# Altium schematic sheet 1) LPC1850_ P0-P4.SchDoc
size 420 x 297 mm
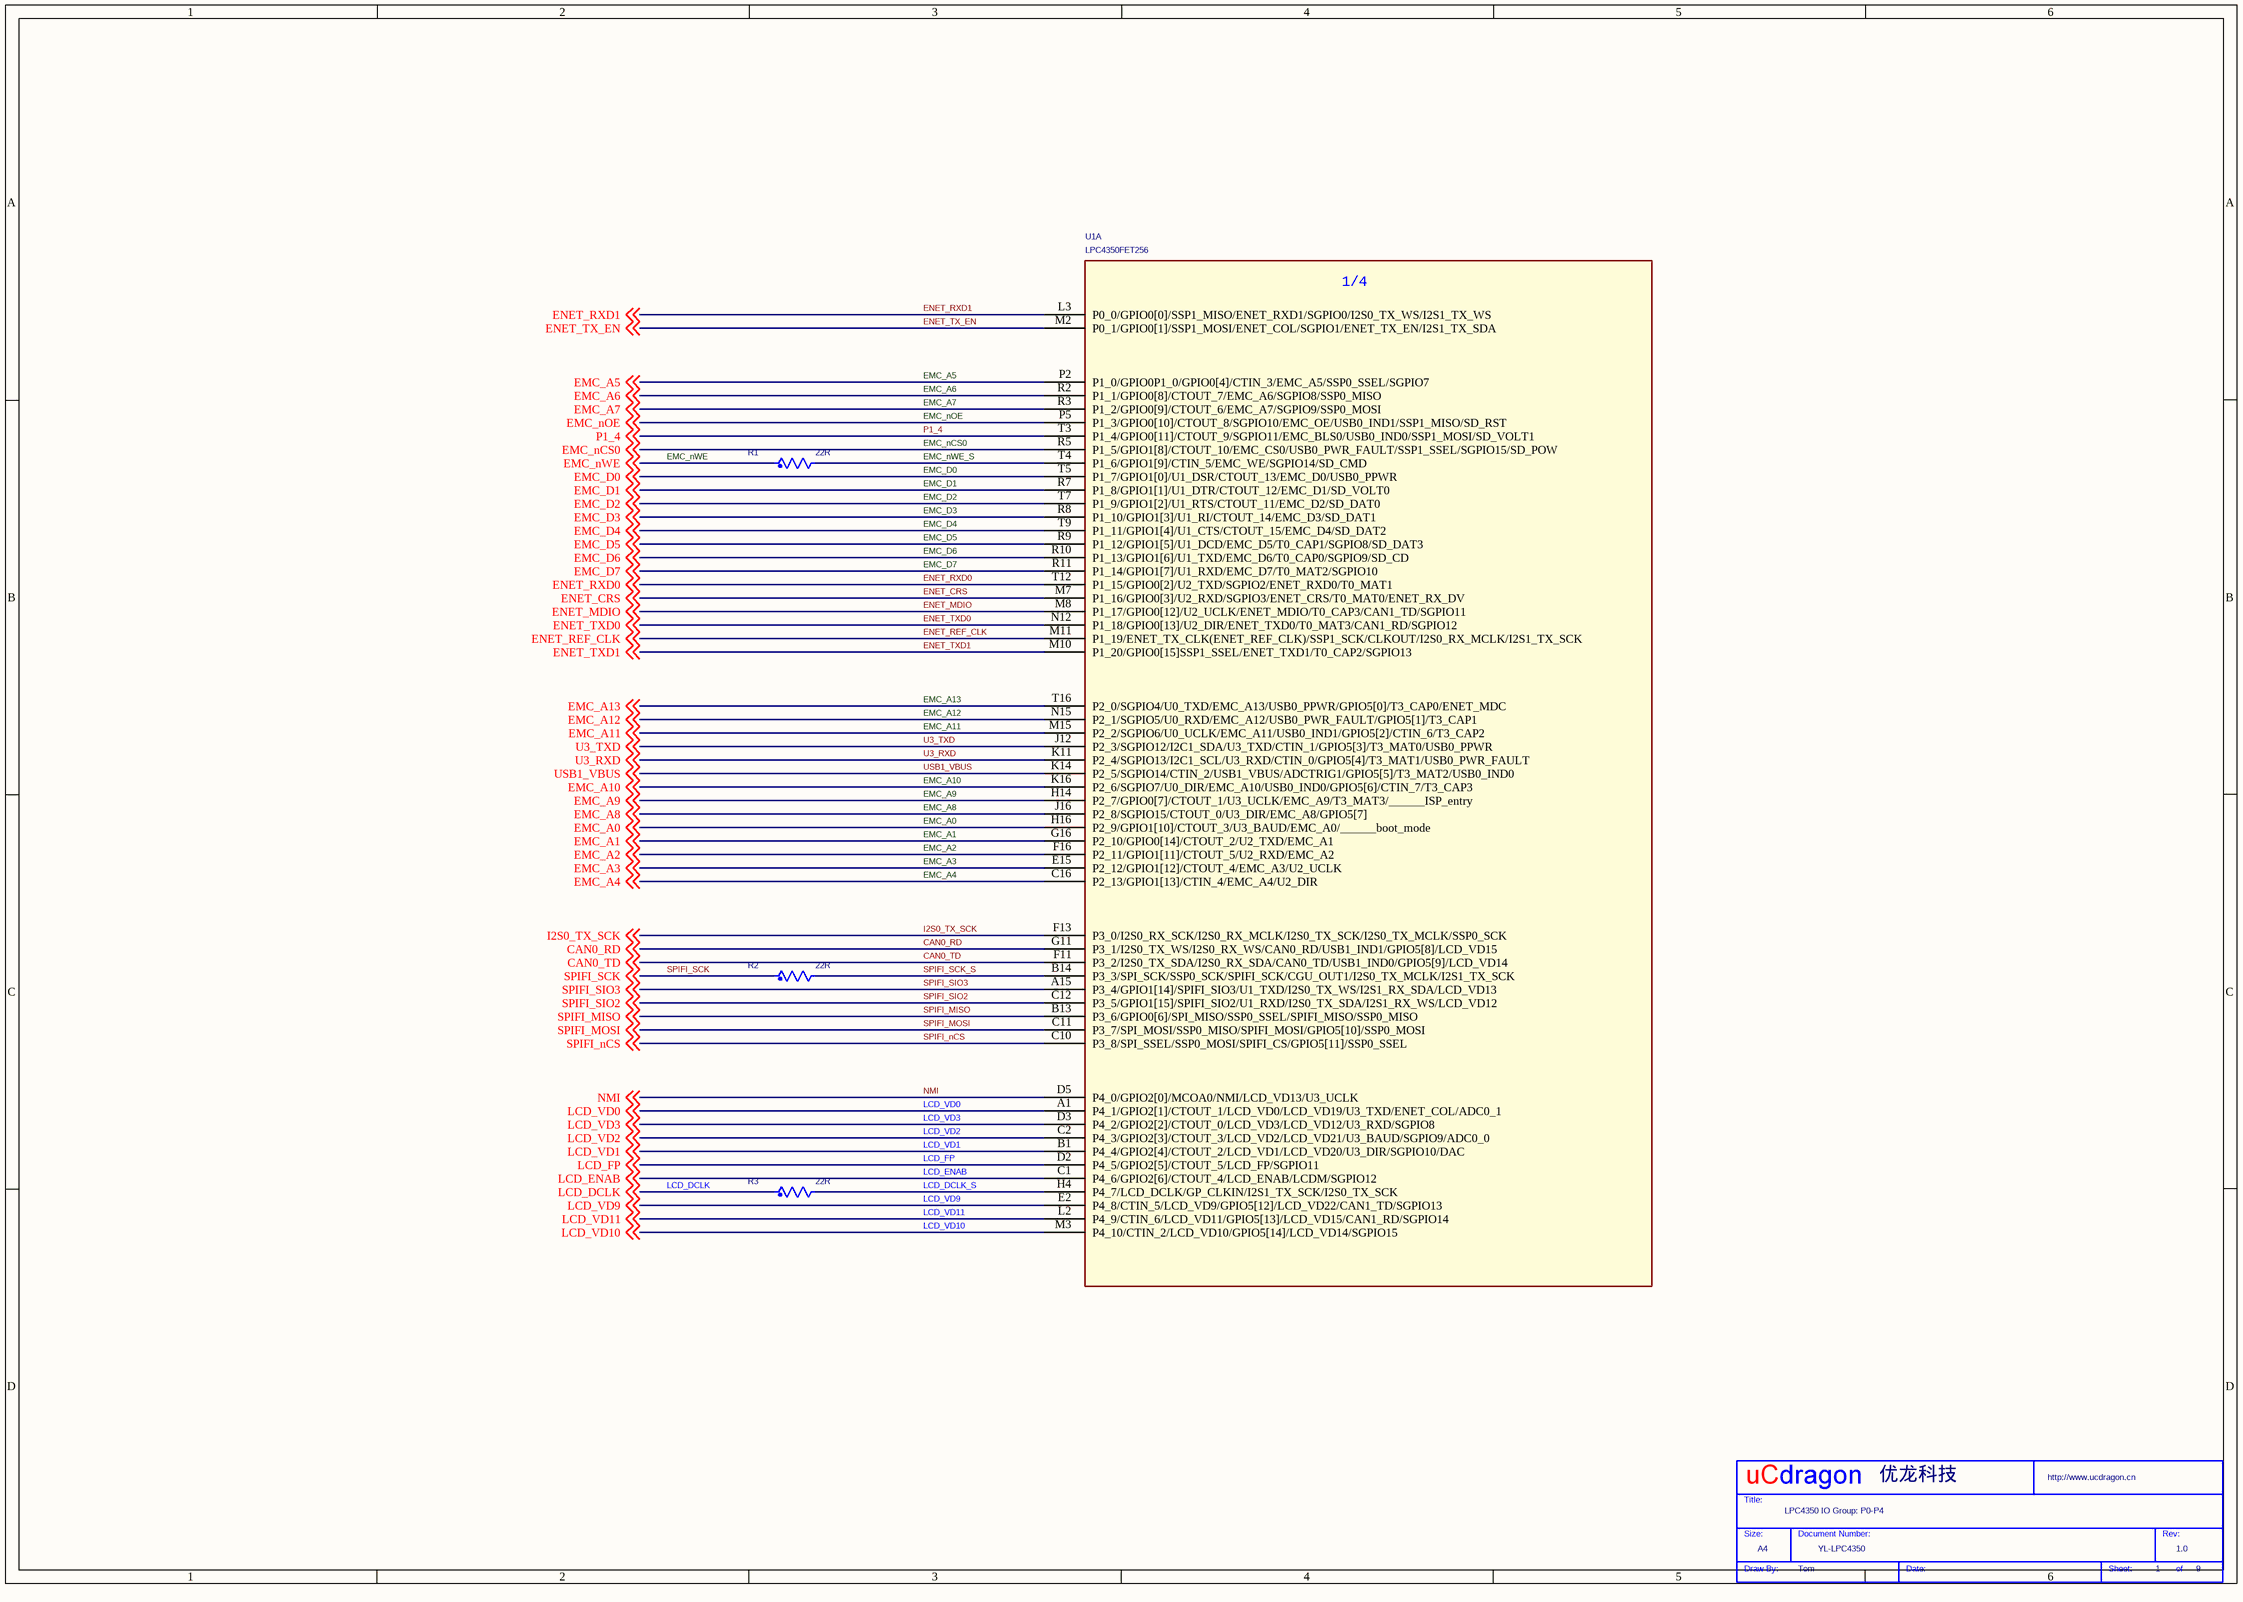
[diagram p0: 1) LPC1850_ P0-P4.SchDoc]

## Parts
*  Company: 优龙科技  Drawing: Tom  Doc: YL-LPC4350  RevCode: 1.0  Title: LPC4350 IO Group: P0-P4  Page Size: A4  Page Number: 1  Page Count: 9  (hidden comment: My Title 0)  (graphical)
R1  22R  [R0603]
R2  22R  [R0603]
R3  22R  [R0603]
U1  LPC4350FET256  [LBGA256]  (part A of 4)

## Nets
CAN0_RD: U1.G11(P3_1/I2S0_TX_WS/I2S0_RX_WS/CAN0_RD/USB1_IND1/GPIO5[8]/LCD_VD15) ; off-sheet CAN0_RD
CAN0_TD: U1.F11(P3_2/I2S0_TX_SDA/I2S0_RX_SDA/CAN0_TD/USB1_IND0/GPIO5[9]/LCD_VD14) ; off-sheet CAN0_TD
EMC_A0: U1.H16(P2_9/GPIO1[10]/CTOUT_3/U3_BAUD/EMC_A0/______boot_mode) ; off-sheet EMC_A0
EMC_A1: U1.G16(P2_10/GPIO0[14]/CTOUT_2/U2_TXD/EMC_A1) ; off-sheet EMC_A1
EMC_A2: U1.F16(P2_11/GPIO1[11]/CTOUT_5/U2_RXD/EMC_A2) ; off-sheet EMC_A2
EMC_A3: U1.E15(P2_12/GPIO1[12]/CTOUT_4/EMC_A3/U2_UCLK) ; off-sheet EMC_A3
EMC_A4: U1.C16(P2_13/GPIO1[13]/CTIN_4/EMC_A4/U2_DIR) ; off-sheet EMC_A4
EMC_A5: U1.P2(P1_0/GPIO0P1_0/GPIO0[4]/CTIN_3/EMC_A5/SSP0_SSEL/SGPIO7) ; off-sheet EMC_A5
EMC_A6: U1.R2(P1_1/GPIO0[8]/CTOUT_7/EMC_A6/SGPIO8/SSP0_MISO) ; off-sheet EMC_A6
EMC_A7: U1.R3(P1_2/GPIO0[9]/CTOUT_6/EMC_A7/SGPIO9/SSP0_MOSI) ; off-sheet EMC_A7
EMC_A8: U1.J16(P2_8/SGPIO15/CTOUT_0/U3_DIR/EMC_A8/GPIO5[7]) ; off-sheet EMC_A8
EMC_A9: U1.H14(P2_7/GPIO0[7]/CTOUT_1/U3_UCLK/EMC_A9/T3_MAT3/______ISP_entry) ; off-sheet EMC_A9
EMC_A10: U1.K16(P2_6/SGPIO7/U0_DIR/EMC_A10/USB0_IND0/GPIO5[6]/CTIN_7/T3_CAP3) ; off-sheet EMC_A10
EMC_A11: U1.M15(P2_2/SGPIO6/U0_UCLK/EMC_A11/USB0_IND1/GPIO5[2]/CTIN_6/T3_CAP2) ; off-sheet EMC_A11
EMC_A12: U1.N15(P2_1/SGPIO5/U0_RXD/EMC_A12/USB0_PWR_FAULT/GPIO5[1]/T3_CAP1) ; off-sheet EMC_A12
EMC_A13: U1.T16(P2_0/SGPIO4/U0_TXD/EMC_A13/USB0_PPWR/GPIO5[0]/T3_CAP0/ENET_MDC) ; off-sheet EMC_A13
EMC_D0: U1.T5(P1_7/GPIO1[0]/U1_DSR/CTOUT_13/EMC_D0/USB0_PPWR) ; off-sheet EMC_D0
EMC_D1: U1.R7(P1_8/GPIO1[1]/U1_DTR/CTOUT_12/EMC_D1/SD_VOLT0) ; off-sheet EMC_D1
EMC_D2: U1.T7(P1_9/GPIO1[2]/U1_RTS/CTOUT_11/EMC_D2/SD_DAT0) ; off-sheet EMC_D2
EMC_D3: U1.R8(P1_10/GPIO1[3]/U1_RI/CTOUT_14/EMC_D3/SD_DAT1) ; off-sheet EMC_D3
EMC_D4: U1.T9(P1_11/GPIO1[4]/U1_CTS/CTOUT_15/EMC_D4/SD_DAT2) ; off-sheet EMC_D4
EMC_D5: U1.R9(P1_12/GPIO1[5]/U1_DCD/EMC_D5/T0_CAP1/SGPIO8/SD_DAT3) ; off-sheet EMC_D5
EMC_D6: U1.R10(P1_13/GPIO1[6]/U1_TXD/EMC_D6/T0_CAP0/SGPIO9/SD_CD) ; off-sheet EMC_D6
EMC_D7: U1.R11(P1_14/GPIO1[7]/U1_RXD/EMC_D7/T0_MAT2/SGPIO10) ; off-sheet EMC_D7
EMC_nCS0: U1.R5(P1_5/GPIO1[8]/CTOUT_10/EMC_CS0/USB0_PWR_FAULT/SSP1_SSEL/SGPIO15/SD_POW) ; off-sheet EMC_nCS0
EMC_nOE: U1.P5(P1_3/GPIO0[10]/CTOUT_8/SGPIO10/EMC_OE/USB0_IND1/SSP1_MISO/SD_RST) ; off-sheet EMC_nOE
EMC_nWE: R1.1 ; off-sheet EMC_nWE
EMC_nWE_S: R1.2 U1.T4(P1_6/GPIO1[9]/CTIN_5/EMC_WE/SGPIO14/SD_CMD)
ENET_CRS: U1.M7(P1_16/GPIO0[3]/U2_RXD/SGPIO3/ENET_CRS/T0_MAT0/ENET_RX_DV) ; off-sheet ENET_CRS
ENET_MDIO: U1.M8(P1_17/GPIO0[12]/U2_UCLK/ENET_MDIO/T0_CAP3/CAN1_TD/SGPIO11) ; off-sheet ENET_MDIO
ENET_REF_CLK: U1.M11(P1_19/ENET_TX_CLK(ENET_REF_CLK)/SSP1_SCK/CLKOUT/I2S0_RX_MCLK/I2S1_TX_SCK) ; off-sheet ENET_REF_CLK
ENET_RXD0: U1.T12(P1_15/GPIO0[2]/U2_TXD/SGPIO2/ENET_RXD0/T0_MAT1) ; off-sheet ENET_RXD0
ENET_RXD1: U1.L3(P0_0/GPIO0[0]/SSP1_MISO/ENET_RXD1/SGPIO0/I2S0_TX_WS/I2S1_TX_WS) ; off-sheet ENET_RXD1
ENET_TX_EN: U1.M2(P0_1/GPIO0[1]/SSP1_MOSI/ENET_COL/SGPIO1/ENET_TX_EN/I2S1_TX_SDA) ; off-sheet ENET_TX_EN
ENET_TXD0: U1.N12(P1_18/GPIO0[13]/U2_DIR/ENET_TXD0/T0_MAT3/CAN1_RD/SGPIO12) ; off-sheet ENET_TXD0
ENET_TXD1: U1.M10(P1_20/GPIO0[15]SSP1_SSEL/ENET_TXD1/T0_CAP2/SGPIO13) ; off-sheet ENET_TXD1
I2S0_TX_SCK: U1.F13(P3_0/I2S0_RX_SCK/I2S0_RX_MCLK/I2S0_TX_SCK/I2S0_TX_MCLK/SSP0_SCK) ; off-sheet I2S0_TX_SCK
LCD_DCLK: R3.1 ; off-sheet LCD_DCLK
LCD_DCLK_S: R3.2 U1.H4(P4_7/LCD_DCLK/GP_CLKIN/I2S1_TX_SCK/I2S0_TX_SCK)
LCD_ENAB: U1.C1(P4_6/GPIO2[6]/CTOUT_4/LCD_ENAB/LCDM/SGPIO12) ; off-sheet LCD_ENAB
LCD_FP: U1.D2(P4_5/GPIO2[5]/CTOUT_5/LCD_FP/SGPIO11) ; off-sheet LCD_FP
LCD_VD0: U1.A1(P4_1/GPIO2[1]/CTOUT_1/LCD_VD0/LCD_VD19/U3_TXD/ENET_COL/ADC0_1) ; off-sheet LCD_VD0
LCD_VD1: U1.B1(P4_4/GPIO2[4]/CTOUT_2/LCD_VD1/LCD_VD20/U3_DIR/SGPIO10/DAC) ; off-sheet LCD_VD1
LCD_VD2: U1.C2(P4_3/GPIO2[3]/CTOUT_3/LCD_VD2/LCD_VD21/U3_BAUD/SGPIO9/ADC0_0) ; off-sheet LCD_VD2
LCD_VD3: U1.D3(P4_2/GPIO2[2]/CTOUT_0/LCD_VD3/LCD_VD12/U3_RXD/SGPIO8) ; off-sheet LCD_VD3
LCD_VD9: U1.E2(P4_8/CTIN_5/LCD_VD9/GPIO5[12]/LCD_VD22/CAN1_TD/SGPIO13) ; off-sheet LCD_VD9
LCD_VD10: U1.M3(P4_10/CTIN_2/LCD_VD10/GPIO5[14]/LCD_VD14/SGPIO15) ; off-sheet LCD_VD10
LCD_VD11: U1.L2(P4_9/CTIN_6/LCD_VD11/GPIO5[13]/LCD_VD15/CAN1_RD/SGPIO14) ; off-sheet LCD_VD11
NMI: U1.D5(P4_0/GPIO2[0]/MCOA0/NMI/LCD_VD13/U3_UCLK) ; off-sheet NMI
P1_4: U1.T3(P1_4/GPIO0[11]/CTOUT_9/SGPIO11/EMC_BLS0/USB0_IND0/SSP1_MOSI/SD_VOLT1) ; off-sheet P1_4
SPIFI_MISO: U1.B13(P3_6/GPIO0[6]/SPI_MISO/SSP0_SSEL/SPIFI_MISO/SSP0_MISO) ; off-sheet SPIFI_MISO
SPIFI_MOSI: U1.C11(P3_7/SPI_MOSI/SSP0_MISO/SPIFI_MOSI/GPIO5[10]/SSP0_MOSI) ; off-sheet SPIFI_MOSI
SPIFI_nCS: U1.C10(P3_8/SPI_SSEL/SSP0_MOSI/SPIFI_CS/GPIO5[11]/SSP0_SSEL) ; off-sheet SPIFI_nCS
SPIFI_SCK: R2.1 ; off-sheet SPIFI_SCK
SPIFI_SCK_S: R2.2 U1.B14(P3_3/SPI_SCK/SSP0_SCK/SPIFI_SCK/CGU_OUT1/I2S0_TX_MCLK/I2S1_TX_SCK)
SPIFI_SIO2: U1.C12(P3_5/GPIO1[15]/SPIFI_SIO2/U1_RXD/I2S0_TX_SDA/I2S1_RX_WS/LCD_VD12) ; off-sheet SPIFI_SIO2
SPIFI_SIO3: U1.A15(P3_4/GPIO1[14]/SPIFI_SIO3/U1_TXD/I2S0_TX_WS/I2S1_RX_SDA/LCD_VD13) ; off-sheet SPIFI_SIO3
U3_RXD: U1.K11(P2_4/SGPIO13/I2C1_SCL/U3_RXD/CTIN_0/GPIO5[4]/T3_MAT1/USB0_PWR_FAULT) ; off-sheet U3_RXD
U3_TXD: U1.J12(P2_3/SGPIO12/I2C1_SDA/U3_TXD/CTIN_1/GPIO5[3]/T3_MAT0/USB0_PPWR) ; off-sheet U3_TXD
USB1_VBUS: U1.K14(P2_5/SGPIO14/CTIN_2/USB1_VBUS/ADCTRIG1/GPIO5[5]/T3_MAT2/USB0_IND0) ; off-sheet USB1_VBUS

## Notes on the sheet
- (in symbol LPC4350FET256, part A) 1/4
- (in symbol My Title 0) Title:; Size:; Document Number:; Rev:; Draw By:; Date:; Sheet:; of

## Library data of the parts
R1-R3 = R_Generic_Dup2
* = My Title 0: WebSite: http://www.ucdragon.cn; Page Create Date: May 29, 2006